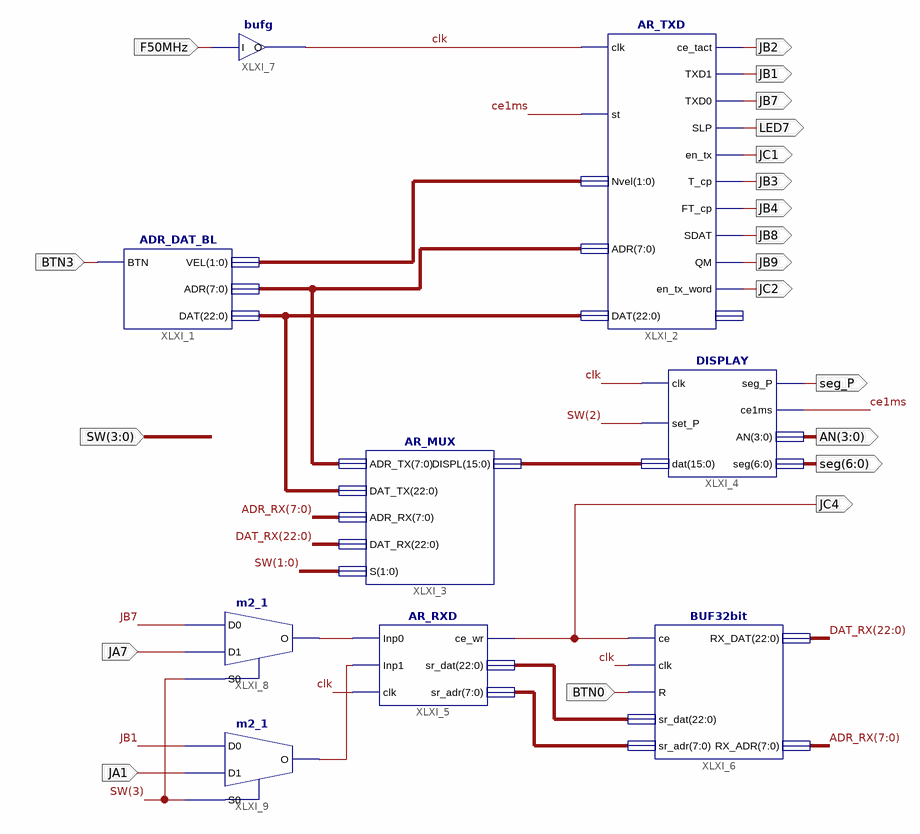
[diagram p0: schematic sheet 1]
// Xilinx ISE schematic Sch_Lab405AD.sch (spartan3e) as structural Verilog: 9 symbols, 20 ports
module Sch_Lab405AD (
  input  F50MHz,
  input  BTN3,
  input  [3:0] SW,
  input  JA7,
  input  JA1,
  input  BTN0,
  output JB2,
  output JB1,
  output JB7,
  output LED7,
  output JC1,
  output JB3,
  output JB4,
  output JB8,
  output JB9,
  output JC2,
  output seg_P,
  output [3:0] AN,
  output [6:0] seg,
  output JC4
);

  wire ce1ms, clk, XLXN_31, XLXN_34;
  wire [1:0] XLXN_7;
  wire [7:0] ADR_RX, XLXN_6, XLXN_45;
  wire [15:0] XLXN_5;
  wire [22:0] DAT_RX, XLXN_4, XLXN_44;

  ADR_DAT_BL XLXI_1 (.BTN(BTN3), .VEL(XLXN_7), .ADR(XLXN_6), .DAT(XLXN_4));
  AR_TXD XLXI_2 (
    .clk(clk), .st(ce1ms), .Nvel(XLXN_7), .ADR(XLXN_6), .DAT(XLXN_4), .ce_tact(JB2), .TXD1(JB1), .TXD0(JB7),
    .SLP(LED7), .en_tx(JC1), .T_cp(JB3), .FT_cp(JB4), .SDAT(JB8), .QM(JB9), .en_tx_word(JC2));  // open: cb_bit
  AR_MUX XLXI_3 (.ADR_TX(XLXN_6), .DAT_TX(XLXN_4), .ADR_RX(ADR_RX), .DAT_RX(DAT_RX), .S(SW[1:0]), .DISPL(XLXN_5));
  DISPLAY XLXI_4 (.clk(clk), .set_P(SW[2]), .dat(XLXN_5), .seg_P(seg_P), .ce1ms(ce1ms), .AN(AN), .seg(seg));
  AR_RXD XLXI_5 (.Inp0(XLXN_31), .Inp1(XLXN_34), .clk(clk), .ce_wr(JC4), .sr_dat(XLXN_44), .sr_adr(XLXN_45));
  BUF32bit XLXI_6 (.ce(JC4), .clk(clk), .R(BTN0), .sr_dat(XLXN_44), .sr_adr(XLXN_45), .RX_DAT(DAT_RX), .RX_ADR(ADR_RX));
  bufg XLXI_7 (.I(F50MHz), .O(clk));
  m2_1 XLXI_8 (.D0(JB7), .D1(JA7), .S0(SW[3]), .O(XLXN_31));
  m2_1 XLXI_9 (.D0(JB1), .D1(JA1), .S0(SW[3]), .O(XLXN_34));
endmodule
